# EasyEDA Pro project ProProject_PetCareSTM32_MiniSTM32_2024-08-24_5.epro

# Schematic Schematic1
Create Date: 2024-08-11; Page Name: P1; Project Name: PetCareSTM32_MiniSTM32; Schematic Name: Schematic1; Update Date: 2024-08-24; Company: 嘉立创EDA; Page Size: A4; Version: V1.0
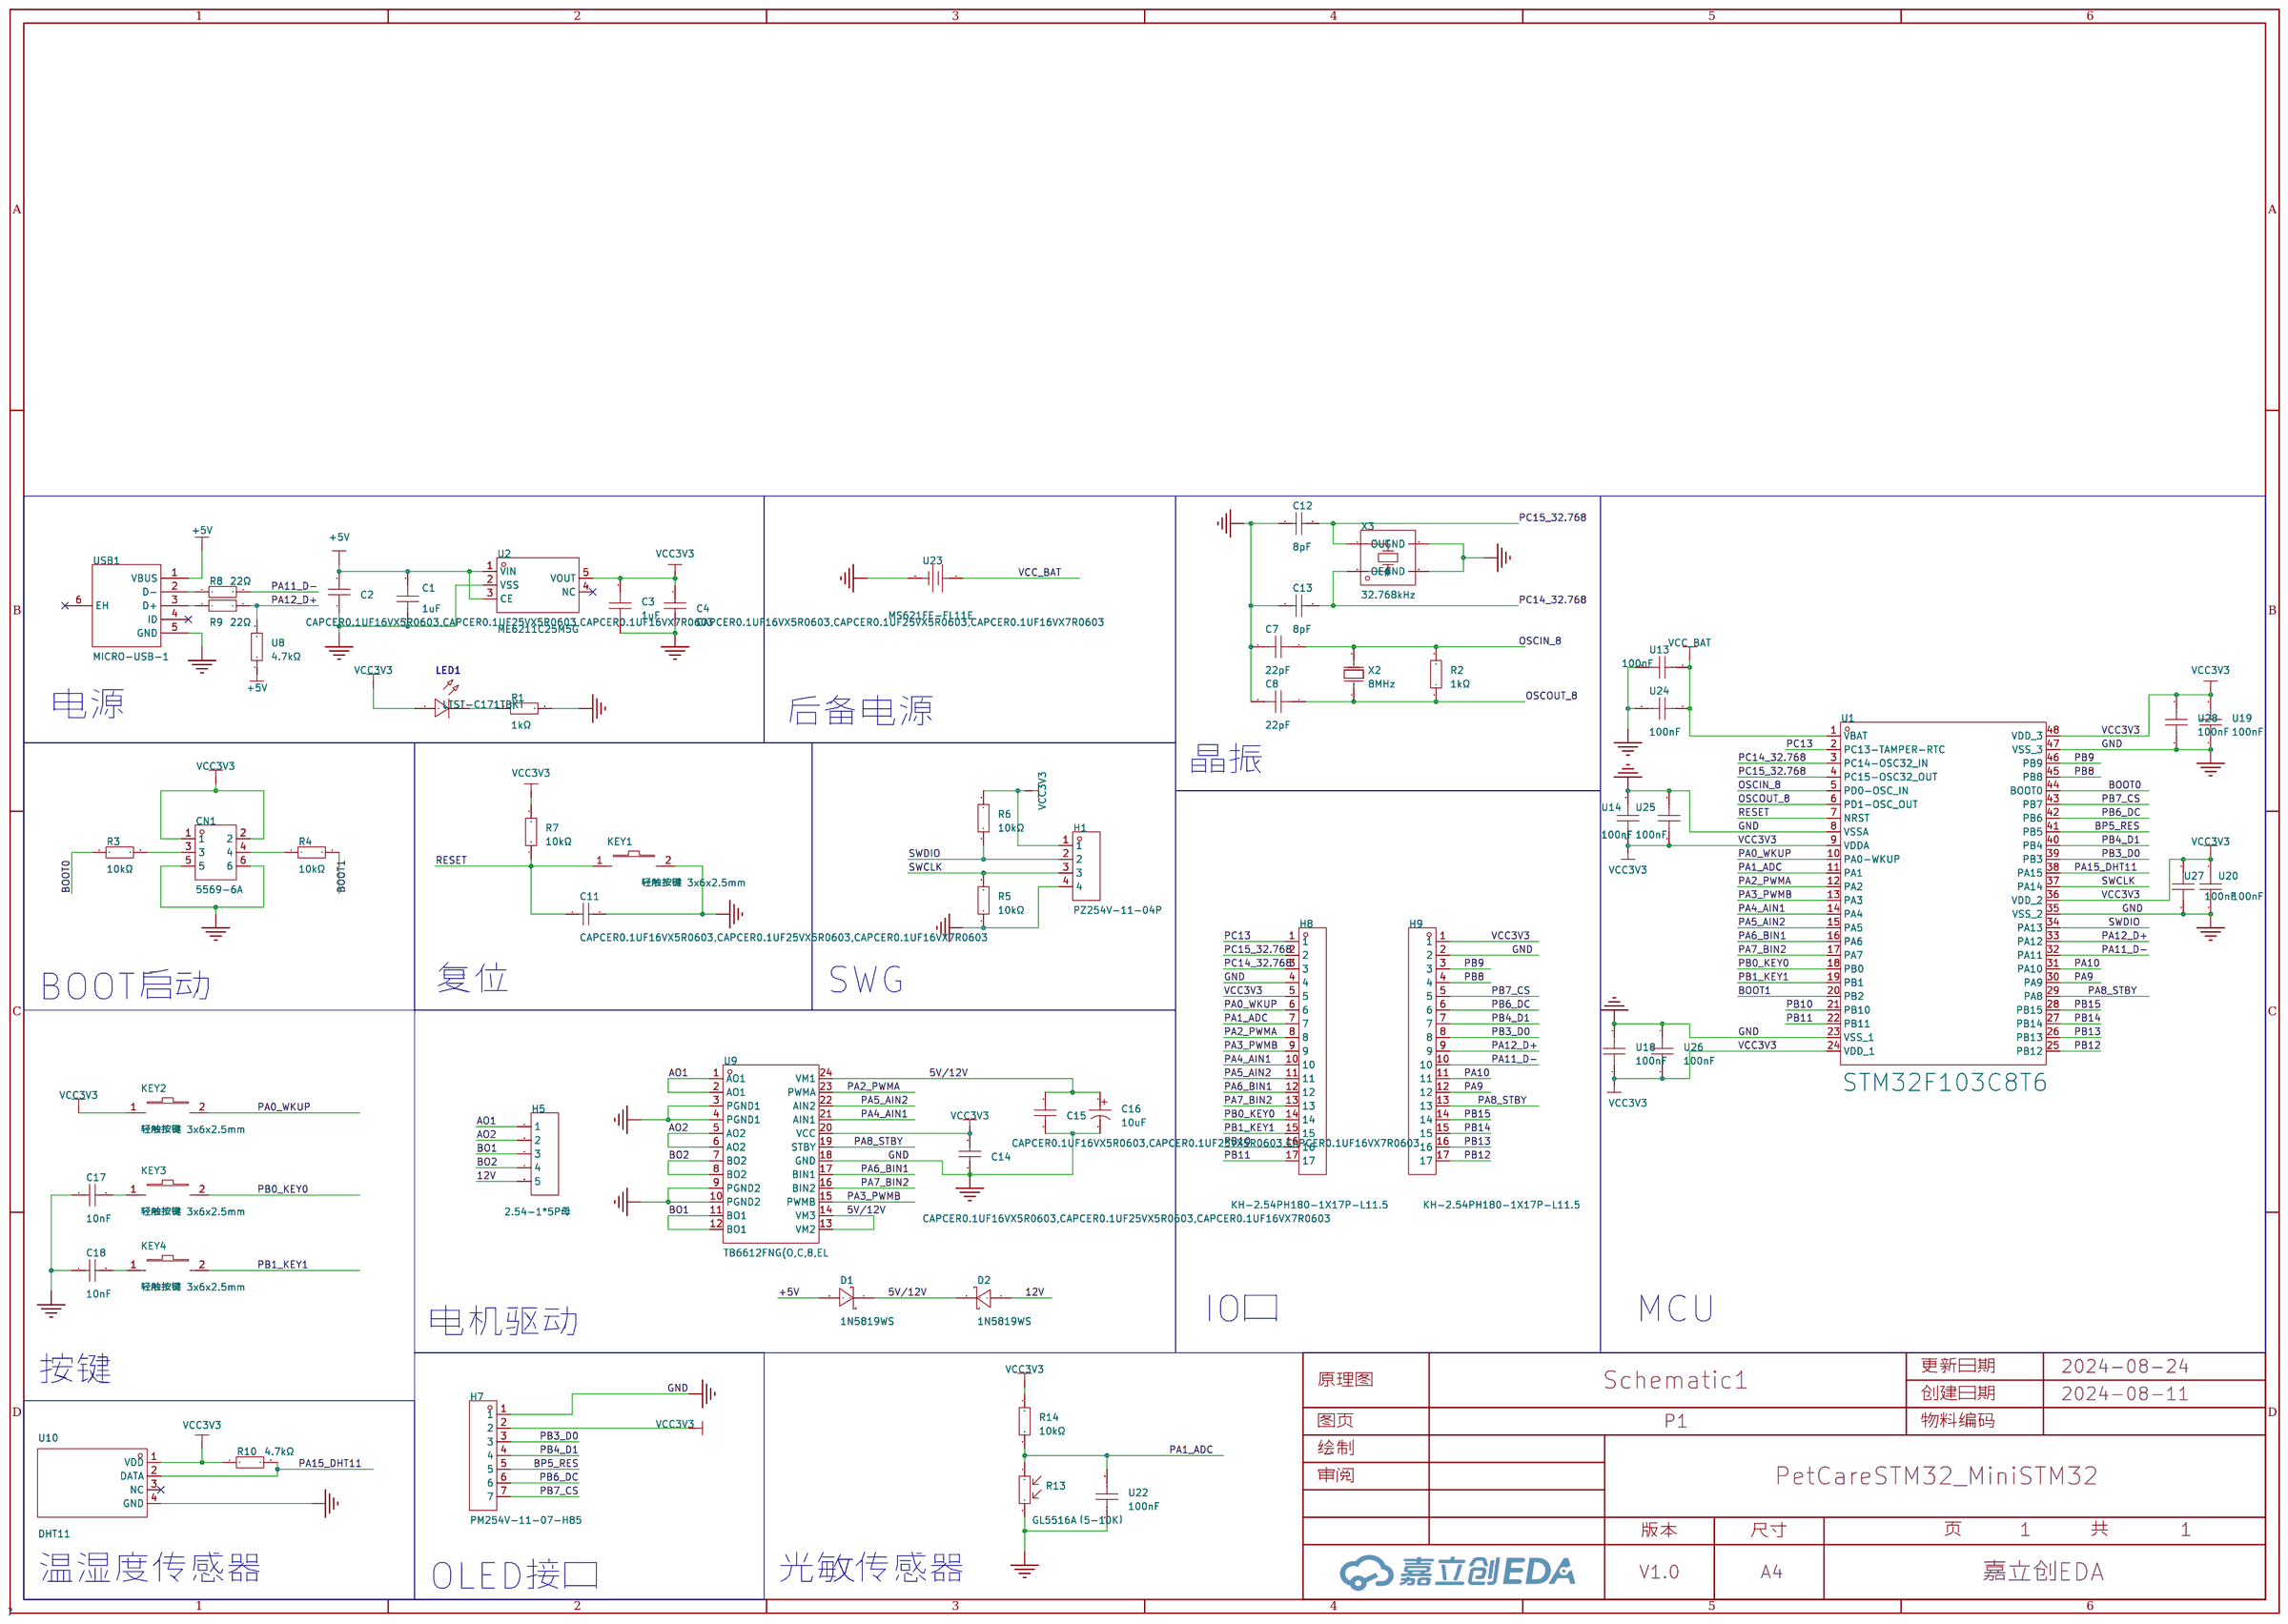
[diagram p0: schematic sheet]

## Parts
C1  1uF  [C0603]
C2  CAPCER0.1UF16VX5R0603,CAPCER0.1UF25VX5R0603,CAPCER0.1UF16VX7R0603  [C0603]
C3  1uF  [C0603]
C4  CAPCER0.1UF16VX5R0603,CAPCER0.1UF25VX5R0603,CAPCER0.1UF16VX7R0603  [C0603]
C7  22pF  [C0603]
C8  22pF  [C0603]
C11  CAPCER0.1UF16VX5R0603,CAPCER0.1UF25VX5R0603,CAPCER0.1UF16VX7R0603  [C0603]
C12  8pF  [C0603]
C13  8pF  [C0603]
C14  CAPCER0.1UF16VX5R0603,CAPCER0.1UF25VX5R0603,CAPCER0.1UF16VX7R0603  [C0603]
C15  CAPCER0.1UF16VX5R0603,CAPCER0.1UF25VX5R0603,CAPCER0.1UF16VX7R0603  [C0603]
C16  10uF  [CAP-TH_BD5.0-P2.00-D0.8-FD]
C17  10nF  [C0603]
C18  10nF  [C0603]
CN1  5569-6A  [CONN-TH_6P-P4.20_5569-6A-1]
D1  1N5819WS  [SOD-323_L1.8-W1.3-LS2.5-RD]
D2  1N5819WS  [SOD-323_L1.8-W1.3-LS2.5-RD]
H1  PZ254V-11-04P  [HDR-TH_4P-P2.54-V-M]
H5  2.54-1*5P母  [HDR-TH_5P-P2.54-V-F]
H7  PM254V-11-07-H85  [HDR-TH_7P-P2.54-V-F]
H8  KH-2.54PH180-1X17P-L11.5  [HDR-TH_17P-P2.54-V-M]
H9  KH-2.54PH180-1X17P-L11.5  [HDR-TH_17P-P2.54-V-M]
KEY1  轻触按键 3x6x2.5mm  [SW-SMD_L6.0-W3.6-LS8.0]
KEY2  轻触按键 3x6x2.5mm  [SW-SMD_L6.0-W3.6-LS8.0]
KEY3  轻触按键 3x6x2.5mm  [SW-SMD_L6.0-W3.6-LS8.0]
KEY4  轻触按键 3x6x2.5mm  [SW-SMD_L6.0-W3.6-LS8.0]
LED1  LTST-C171TBKT  [LED0805-RD_BLUE]
R1  1kΩ  [R0603]
R2  1kΩ  [R0603]
R3  10kΩ  [R0603]
R4  10kΩ  [R0603]
R5  10kΩ  [R0603]
R6  10kΩ  [R0603]
R7  10kΩ  [R0603]
R8  22Ω  [R0805]
R9  22Ω  [R0805]
R10  4.7kΩ  [R1206]
R13  GL5516A（5-10K）  [RES-TH_L5.1-W4.3-P3.40_GL55]
R14  10kΩ  [R0603]
U1  STM32F103C8T6  [LQFP-48_L7.0-W7.0-P0.50-LS9.0-BL]
U2  ME6211C25M5G  [SOT-23-5_L2.9-W1.7-P0.95-LS2.8-BL]
U8  4.7kΩ  [R0603]
U9  TB6612FNG(O,C,8,EL  [SSOP-24_L8.4-W5.8-P0.65-LS7.8-BL]
U10  DHT11  [SENSOR-TH_DHT11]
U13  100nF  [C0603]
U14  100nF  [C0603]
U18  100nF  [C0603]
U19  100nF  [C0603]
U20  100nF  [C0603]
U22  100nF  [C0603]
U23  MS621FE-FL11E  [BAT-SMD_FL11E]
U24  100nF  [C0603]
U25  100nF  [C0603]
U26  100nF  [C0603]
U27  100nF  [C0603]
U28  100nF  [C0603]
USB1  MICRO-USB-1  [MICRO-USB-SMD_C9900008946]
X2  8MHz  [OSC-SMD_L5.0-W3.2]
X3  32.768kHz  [CRYSTAL-SMD_4P-L8.0-W3.8-BL]

## Library data of the parts
C1 C3 = CL10A105KB8NNNC: 容值:1uF;精度:±10%;额定电压:50V;材质(温度系数):X5R;; LCSC Part Name: 1uF ±10% 50V; Supplier Part: C15849; Manufacturer: SAMSUNG(三星); Supplier Footprint: 0603; JLCPCB Part Class: Basic Part; Datasheet: https://atta.szlcsc.com/upload/public/pdf/source/20160218/1457707763339.pdf; Supplier: LCSC; Tolerance: ±10%; Voltage Rated: 50V; Temperature Coefficient: X5R
C2 C4 C11 C14 C15 = CAPCER0.1UF16VX5R0603,CAPCER0.1UF25VX5R0603,CAPCER0.1UF16VX7R0603: Supplier Part: C9900012833; JLCPCB Part Class: Extended Part; Supplier: LCSC
C7 C8 = CL10C220JB81PNC: 容值:22pF;精度:±5%;额定电压:50V;材质(温度系数):C0G;; LCSC Part Name: 22pF ±5% 50V; Supplier Part: C170132; Manufacturer: SAMSUNG(三星); Supplier Footprint: 0603; JLCPCB Part Class: Extended Part; Datasheet: https://atta.szlcsc.com/upload/public/pdf/source/20180126/C170132_15169630833661310807.pdf; Supplier: LCSC; Tolerance: ±5%; Voltage Rated: 50V; Temperature Coefficient: C0G
C12 C13 = 0603CG8R0C500NT: 容值:8pF;额定电压:50V;材质(温度系数):C0G;; LCSC Part Name: 8pF 50V; Supplier Part: C36508; Manufacturer: FH(风华); Supplier Footprint: 0603; JLCPCB Part Class: Extended Part; Datasheet: https://atta.szlcsc.com/upload/public/pdf/source/20200305/C486355_26A10D38EF8C2A5C37091D0039909270.pdf; Supplier: LCSC; Voltage Rated: 50V; Temperature Coefficient: C0G
C16 = KF100M025C110A: 容值:10uF;精度:±20%;额定电压:25V;; LCSC Part Name: 10uF ±20% 25V; Supplier Part: C62930; Manufacturer: CapXon(丰宾); Supplier Footprint: 插件,D5xL11mm; JLCPCB Part Class: Extended Part; Datasheet: https://atta.szlcsc.com/upload/public/pdf/source/20160702/1467448308274.pdf; Supplier: LCSC; Tolerance: ±20%; Rated Voltage: 25V; Lead Spacing: 2mm; φD: 5mm; L: 11mm; Lifetime @ Temp: 2000hrs@105℃
C17 C18 = CC0603KRX7R9BB103: 容值:10nF;精度:±10%;额定电压:50V;材质(温度系数):X7R;; LCSC Part Name: 10nF ±10% 50V; Supplier Part: C100042; Manufacturer: YAGEO(国巨); Supplier Footprint: 0603; JLCPCB Part Class: Extended Part; Datasheet: https://atta.szlcsc.com/upload/public/pdf/source/20181008/C309510_22F155564471FAF6A489F7D68F34234E.pdf; Supplier: LCSC; Tolerance: ±10%; Voltage Rated: 50V; Temperature Coefficient: X7R
CN1 = 5569-6A: Supplier Part: C9900070523; Supplier Footprint: 2*3p; JLCPCB Part Class: Extended Part; Supplier: LCSC
D1 D2 = 1N5819WS_C191023: 正向压降(Vf):600mV@1A;直流反向耐压(Vr):40V;平均整流电流(Io):1A;; LCSC Part Name: 电压:40V 电流:1A; Supplier Part: C191023; Manufacturer: Hottech(合科泰); Supplier Footprint: SOD-323; JLCPCB Part Class: Basic Part; Datasheet: https://atta.szlcsc.com/upload/public/pdf/source/20220428/3CB86FD8D28D653594B4E35F9D5AEFD9.pdf; Supplier: LCSC; Forward Voltage (Vf@If): 600mV@1A; Reverse Voltage (Vr): 40V; Average Rectified Current (Io): 1A
H1 = PZ254V-11-04P: 插针结构:1x4P;间距:2.54mm;行距:-;圆针/方针:方针;安装类型:直插;排数:单排;总PIN位数:4P;额定电流:3A;额定电压:250V;配合针长度:6mm;塑高:2.5mm;端接针长度:3mm;触头材质:-;工作温度范围:-40℃~+105℃;颜色:黑色;; LCSC Part Name: 间距:2.54mm 1x4P 直插 方针; Supplier Part: C2691448; Manufacturer: XFCN(兴飞); Supplier Footprint: 插件,P=2.54mm; JLCPCB Part Class: Extended Part; Datasheet: https://atta.szlcsc.com/upload/public/pdf/source/20200309/C492403_F9F19131791D08044AD4F84F8E751A34.pdf; Supplier: LCSC; Pin Structure: 1x4P; Pitch: 2.54mm; Circluar Pins/Square Pins: 方针; Mounting Type: 直插; Number of Rows: 单排; Number of Pins: 4P; Current Rating (Max): 3A; Voltage Rating (Max): 250V; Length of Mating Pin: 6mm; Insulation Height: 2.5mm; Length of End Connection Pin: 3mm; Operating Temperature Range: -40℃~+105℃; Color: 黑色
H5 = 2.54-1*5P母: 插孔结构:1x5P;间距:2.54mm;行距:-;安装类型:直插;排数:单排;总孔位数:5P;塑高:-;触头材质:-;触头镀层:-;; LCSC Part Name: 间距:2.54mm 1x5P 直插; Supplier Part: C50950; Manufacturer: BOOMELE(博穆精密); Supplier Footprint: 插件,P=2.54mm; JLCPCB Part Class: Extended Part; Datasheet: https://atta.szlcsc.com/upload/public/pdf/source/20210301/C2718488_F4427B881E42CAA8DDB0B1C12B3A522C.pdf; Supplier: LCSC; Holes Structure: 1x5P; Pitch: 2.54mm; Mounting Type: 直插; Number of Rows: 单排; Number of Holes: 5P
H7 = PM254V-11-07-H85: 插孔结构:1x7P;间距:2.54mm;行距:-;圆孔/方孔:方孔;安装类型:直插;排数:单排;总孔位数:7P;额定电流:3A;额定电压:250V;插孔方向:顶部;塑高:-;工作温度范围:-40℃~+105℃;; LCSC Part Name: 间距:2.54mm 1x7P 直插; Supplier Part: C2832270; Manufacturer: XFCN(兴飞); Supplier Footprint: 插件,P=2.54mm; JLCPCB Part Class: Extended Part; Datasheet: https://atta.szlcsc.com/upload/public/pdf/source/20210514/C2832270_F424CC0071A81298BFB56B53406F9842.pdf; Supplier: LCSC; Holes Structure: 1x7P; Pitch: 2.54mm; Circular Hole / Square Hole: 方孔; Mounting Type: 直插; Number of Rows: 单排; Number of Holes: 7P; Current Rating (Max): 3A; Voltage Rating (Max): 250V; Holes Direction: 顶部; Operating Temperature Range: -40℃~+105℃
H8 H9 = KH-2.54PH180-1X17P-L11.5: 插针结构:1x17P;间距:2.54mm;行距:-;圆针/方针:方针;安装类型:直插;排数:单排;总PIN位数:17P;额定电流:3A;额定电压:-;配合针长度:6mm;塑高:2.5mm;端接针长度:3mm;工作温度范围:-40℃~+105℃;颜色:黑色;; LCSC Part Name: 间距:2.54mm 1x17P 直插 方针; Supplier Part: C2932705; Manufacturer: kinghelm(金航标); Supplier Footprint: 插件,P=2.54mm; JLCPCB Part Class: Extended Part; Datasheet: https://atta.szlcsc.com/upload/public/pdf/source/20211220/20932CDD9C2552710798341E35ADE8E4.pdf; Supplier: LCSC; Pin Structure: 1x17P; Pitch: 2.54mm; Circluar Pins/Square Pins: 方针; Mounting Type: 直插; Number of Rows: 单排; Number of Pins: 17P; Current Rating (Max): 3A; Length of Mating Pin: 6mm; Insulation Height: 2.5mm; Length of End Connection Pin: 3mm; Operating Temperature Range: -40℃~+105℃; Color: 黑色
KEY1-KEY4 = 轻触按键 3x6x2.5mm: LCSC Part Name: 3x6x2.5 红头 耐高温; Supplier Part: C5382; Supplier Footprint: SMD; JLCPCB Part Class: Extended Part; Supplier: LCSC
LED1 = LTST-C171TBKT: 发光颜色:蓝色;正向电压(VF):3.3V;功率:76mW;正向电流:20mA;主波长:465nm~475nm;二极管配置:-;透镜颜色:无色透明透镜;色温:-;发光强度:104mcd;发光角度:130°;载带方式:-;工作温度:-20℃~+80℃;; LCSC Part Name: 蓝灯; Supplier Part: C98225; Manufacturer: LITEON(光宝); Supplier Footprint: 0805; JLCPCB Part Class: Extended Part; Datasheet: https://atta.szlcsc.com/upload/public/pdf/source/20170818/C98225_1503051350955895434.pdf; Supplier: LCSC; Emitted Color: 蓝色; Forward Voltage (VF): 3.3V; Power Dissipation: 76mW; Forward Current: 20mA; Dominant Wavelength: 465nm~475nm; Peak Wavelength: 468nm; Lens Color: 无色透明透镜; Luminous Intensity: 104mcd; Viewing Angle: 130°; Operating Temperature: -20℃~+80℃
R1 = RC0603FR-071KL: 电阻类型:厚膜电阻;阻值:1kΩ;精度:±1%;功率:100mW;最大工作电压:75V;温度系数:±100ppm/℃;; LCSC Part Name: 厚膜电阻 1kΩ ±1% 100mW; Supplier Part: C22548; Manufacturer: YAGEO(国巨); Supplier Footprint: 0603; JLCPCB Part Class: Extended Part; Datasheet: https://atta.szlcsc.com/upload/public/pdf/source/20180316/70C0E2BDAE7FCC62C531A5A58D202EE1.pdf; Supplier: LCSC; Type: 厚膜电阻; Tolerance: ±1%; Power(Watts): 100mW; Overload Voltage (Max): 75V; Temperature Coefficient: ±100ppm/℃; Operating Temperature Range: -55℃~+155℃
R2 = 0603WAD1001T5E: 电阻类型:厚膜电阻;阻值:1kΩ;精度:±0.5%;功率:100mW;最大工作电压:75V;温度系数:±100ppm/℃;; LCSC Part Name: 1kΩ ±0.5% 100mW 厚膜电阻; Supplier Part: C51218; Manufacturer: UNI-ROYAL(厚声); Supplier Footprint: 0603; JLCPCB Part Class: Extended Part; Datasheet: https://atta.szlcsc.com/upload/public/pdf/source/20200306/C422600_1E6D84923E4A46A82E41ADD87F860B5C.pdf; Supplier: LCSC; Type: 厚膜电阻; Tolerance: ±0.5%; Power(Watts): 100mW; Overload Voltage (Max): 75V; Temperature Coefficient: ±100ppm/℃; Operating Temperature Range: -55℃~+155℃
R3-R7 R14 = 0603WAF1002T5E: 电阻类型:厚膜电阻;阻值:10kΩ;精度:±1%;功率:100mW;最大工作电压:75V;温度系数:±100ppm/℃;; LCSC Part Name: 厚膜电阻 10kΩ ±1% 100mW; Supplier Part: C25804; Manufacturer: UNI-ROYAL(厚声); Supplier Footprint: 0603; JLCPCB Part Class: Basic Part; Datasheet: https://atta.szlcsc.com/upload/public/pdf/source/20200306/C422600_1E6D84923E4A46A82E41ADD87F860B5C.pdf; Supplier: LCSC; Type: 厚膜电阻; Tolerance: ±1%; Power(Watts): 100mW; Overload Voltage (Max): 75V; Temperature Coefficient: ±100ppm/℃; Operating Temperature Range: -55℃~+155℃
R8 R9 = TC0525F220JT5E: 电阻类型:薄膜电阻;阻值:22Ω;精度:±1%;功率:250mW;最大工作电压:150V;温度系数:±25ppm/℃;; LCSC Part Name: 22Ω ±1% 250mW 薄膜电阻; Supplier Part: C65068; Manufacturer: UNI-ROYAL(厚声); Supplier Footprint: 0805; JLCPCB Part Class: Extended Part; Datasheet: https://atta.szlcsc.com/upload/public/pdf/source/20190904/C425668_F2F639A313B6F33D501F342892FD5229.pdf; Supplier: LCSC; Type: 薄膜电阻; Tolerance: ±1%; Power(Watts): 250mW; Overload Voltage (Max): 150V; Temperature Coefficient: ±25ppm/℃; Operating Temperature Range: -55℃~+155℃
R10 = 1206W4F4701T5E: 电阻类型:厚膜电阻;阻值:4.7kΩ;精度:±1%;功率:250mW;最大工作电压:200V;温度系数:±100ppm/℃;; LCSC Part Name: 4.7kΩ ±1% 250mW 厚膜电阻; Supplier Part: C17936; Manufacturer: UNI-ROYAL(厚声); Supplier Footprint: 1206; JLCPCB Part Class: Basic Part; Datasheet: https://atta.szlcsc.com/upload/public/pdf/source/20200306/C422600_1E6D84923E4A46A82E41ADD87F860B5C.pdf; Supplier: LCSC; Type: 厚膜电阻; Tolerance: ±1%; Power(Watts): 250mW; Overload Voltage (Max): 200V; Temperature Coefficient: ±100ppm/℃; Operating Temperature Range: -55℃~+155℃
R13 = GL5516A（5-10K）: 暗电阻:200kΩ;亮电阻 @ 10Lux:5kΩ~10kΩ;光谱峰值(波长):540nm;; LCSC Part Name: 亮电阻:5kΩ~10kΩ 暗电阻:200kΩ; Supplier Part: C11307; Manufacturer: JCHL(晶创和立); Supplier Footprint: 插件,P=3.4mm; JLCPCB Part Class: Extended Part; Datasheet: https://atta.szlcsc.com/upload/public/pdf/source/20200417/C515010_C10502EF7F431E893A7F20DB83F527F0.pdf; Supplier: LCSC; Dark Resistance: 200kΩ; Illuminated Resistance @ 10Lux: 5kΩ~10kΩ; Applied Voltage: 150V; Spectral Peak: 540nm
U1 = STM32F103C8T6: CPU内核:ARM-M3;程序存储容量:64KB;RAM总容量:20KB;GPIO端口数量:37;工作电压范围:2V~3.6V;CPU最大主频:72MHz;程序存储器类型:FLASH;; LCSC Part Name: 主流增强型ARM Cortex-M3 MCU，具有64 KB Flash、72 MHz CPU、电机控制、USB和CAN; Supplier Part: C8734; Manufacturer: ST(意法半导体); Supplier Footprint: LQFP-48(7x7); JLCPCB Part Class: 扩展库; Datasheet: https://atta.szlcsc.com/upload/public/pdf/source/20220812/8363ACEC51AD55ECEB84799464F7CB85.pdf; Supplier: LCSC; CPU Core: ARM-M3; Program Storage Size: 64KB; RAM Size: 20KB; GPIO Ports Number: 37; Operating Voltage Range: 2V~3.6V; CPU Maximum Speed: 72MHz; Program Memory Type: FLASH; Operating Temperature Range: -40℃~+85℃; ADC (Bit): 12bit; Universal Serial Bus: 有; Peripheral/Function: 看门狗；DMA；看门狗；温度传感器; Watchdog: 有; Infrared Data Association: 有; Low-Voltage Detect: 有; Direct Memory Access: 有; Internal Oscillator: 有
U2 = ME6211C25M5G: LCSC Part Name: ME6211C25M5G 停产; Supplier Part: C2835813; Manufacturer: MICRONE(南京微盟); Supplier Footprint: SOT-23-5; JLCPCB Part Class: Extended Part; Datasheet: https://atta.szlcsc.com/upload/public/pdf/source/20211210/ACC7C3E9BA56F250BF966425916E32B9.pdf; Supplier: LCSC
U8 = AR03FTDX4701A: 电阻类型:薄膜电阻;阻值:4.7kΩ;精度:±1%;功率:100mW;最大工作电压:75V;温度系数:±50ppm/℃;; LCSC Part Name: 薄膜电阻 4.7kΩ ±1% 100mW; Supplier Part: C2924150; Manufacturer: Viking(光颉); Supplier Footprint: 0603; JLCPCB Part Class: Extended Part; Datasheet: https://atta.szlcsc.com/upload/public/pdf/source/20211123/7AFDB03DAF68AA91648A852AAE26A3AB.pdf; Supplier: LCSC; Type: 薄膜电阻; Tolerance: ±1%; Power(Watts): 100mW; Overload Voltage (Max): 75V; Temperature Coefficient: ±50ppm/℃; Operating Temperature Range: -55℃~+155℃
U9 = TB6612FNG(O,C,8,EL: 双直流电机驱动器集成电路; Supplier Part: C88224; Manufacturer: TOSHIBA(东芝); Supplier Footprint: SSOP-24-208mil; JLCPCB Part Class: Extended Part; Datasheet: https://atta.szlcsc.com/upload/public/pdf/source/20171128/C141517_15118625624231147036.pdf; Supplier: LCSC
U10 = DHT11: 新款电容式数字温湿度传感器,老款已停产16.1x12.6x5.8mm; LCSC Part Name: DHT11  电容式传感器; Supplier Part: C117051; Manufacturer: 广州奥松; Supplier Footprint: SIP-4; JLCPCB Part Class: Extended Part; Datasheet: https://atta.szlcsc.com/upload/public/pdf/source/20170703/1499081238365.pdf; Supplier: LCSC
U13 U14 U18-U20 U22 U24-U28 = CGA0603X7R104K500JT: 容值:100nF;精度:±10%;额定电压:50V;材质(温度系数):X7R;; LCSC Part Name: 100nF ±10% 50V; Supplier Part: C6119867; Manufacturer: HRE(芯声); Supplier Footprint: 0603; JLCPCB Part Class: Extended Part; Supplier: LCSC; Tolerance: ±10%; Voltage Rated: 50V; Temperature Coefficient: X7R
U23 = MS621FE-FL11E: FL11E 3.3V可充电纽扣电池 5.5mAH; LCSC Part Name: Seiko/精工，可充电纽扣电池，3V，MS621FE-FL11E，1个; Supplier Part: C80909; Manufacturer: Seiko(精工); JLCPCB Part Class: Extended Part; Datasheet: https://atta.szlcsc.com/upload/public/pdf/source/20230719/88F2811CC6B30DD05F1C5A5953BF9E77.pdf; Supplier: LCSC; voltage: 3 V; capacity: 5.5mAh; chemical composition: 锂离子; temperature range: -20-60°C; type: 纽扣; characteristic: 可充电; Packaging quantity: 1; Battery capacity: -；-；-
USB1 = MICRO-USB-1: Supplier Part: C9900008946; Supplier Footprint: USB-micro; JLCPCB Part Class: Extended Part; Supplier: LCSC
X2 = ABM3-8.000MHZ-D2Y-T: 晶振类型:贴片晶振;频率:8MHz;常温频差:±20ppm;外接负载电容:18pF;频率稳定度(全温):±30ppm;; LCSC Part Name: 8MHz ±20ppm 18pF; Supplier Part: C144380; Manufacturer: ABRACON; Supplier Footprint: SMD5032; JLCPCB Part Class: Extended Part; Datasheet: https://atta.szlcsc.com/upload/public/pdf/source/20180613/C148313_0A3B1F233FF88ED3B220BE4C181ABF14.pdf; Supplier: LCSC; Crystal Type: 贴片晶振; Normal temperature Frequency Tolerance: ±20ppm; External load capacitor: 18pF; Frequency Stability(Full temperature range): ±30ppm; Equivalent Series Resistance (ESR): 140Ω; Operating Temperature: -40℃~+85℃
X3 = ABS25-32.768KHZ-T: 晶振类型:-;频率:32.768kHz;常温频差:±20ppm;外接负载电容:12.5pF;频率稳定度(全温):-;; LCSC Part Name: 32.768kHz ±20ppm 12.5pF; Supplier Part: C179637; Manufacturer: ABRACON; Supplier Footprint: MC-306; JLCPCB Part Class: 扩展库; Datasheet: https://atta.szlcsc.com/upload/public/pdf/source/20180207/C179637_15179896523281356363.pdf; Supplier: LCSC; Normal temperature Frequency Tolerance: ±20ppm; External load capacitor: 12.5pF; Equivalent Series Resistance (ESR): 50kΩ; Operating Temperature: -40℃~+85℃

## Nets
5V/12V: C15.2 C16.1 D1.1(K) D2.1(K) U9.13(VM2) U9.14(VM3) U9.24(VM1)
12V: D2.2(A) H5.5
+5V: C1.2 C2.2 D1.2(A) U2.1(VIN) U2.3(CE) U8.1 USB1.1(VBUS)
GND: C1.1 C2.1 C3.1 C4.1 C7.2 C8.2 C11.2 C12.1 C13.1 C14.1 C15.1 C16.2 C17.2 C18.1 CN1.5 CN1.6 H1.4 H7.1 H8.4 H9.2 KEY1.2 R1.2 R5.1 R13.2 U1.8(VSSA) U1.23(VSS_1) U1.35(VSS_2) U1.47(VSS_3) U2.2(VSS) U9.3(PGND1) U9.4(PGND1) U9.9(PGND2) U9.10(PGND2) U9.18(GND) U10.4(GND) U13.2 U14.2 U18.2 U19.1 U20.1 U22.1 U23.2(-) U24.2 U25.1 U26.1 U27.2 U28.2 USB1.5(GND) X3.2(GND) X3.3(GND)
VCC3V3: C3.2 C4.2 C14.2 CN1.1 CN1.2 H1.1 H7.2 H8.5 H9.1 KEY2.1 LED1.2(A) R6.2 R7.2 R10.1 R14.2 U1.9(VDDA) U1.24(VDD_1) U1.36(VDD_2) U1.48(VDD_3) U2.5(VOUT) U9.20(VCC) U10.1(VDD) U14.1 U18.1 U19.2 U20.2 U25.2 U26.2 U27.1 U28.1
VCC_BAT: U1.1(VBAT) U13.1 U23.1(+) U24.1
AO1: H5.1 U9.1(AO1) U9.2(AO1)
AO2: H5.2 U9.5(AO2) U9.6(AO2)
BO1: H5.3 U9.11(BO1) U9.12(BO1)
BO2: H5.4 U9.7(BO2) U9.8(BO2)
BOOT0: R3.1 U1.44(BOOT0)
BOOT1: R4.2 U1.20(PB2)
BP5_RES: H7.5 U1.41(PB5)
OSCIN_8: C7.1 R2.2 U1.5(PD0-OSC_IN) X2.2(OSC2)
OSCOUT_8: C8.1 R2.1 U1.6(PD1-OSC_OUT) X2.1(OSC1)
PA0_WKUP: H8.6 KEY2.2 U1.10(PA0-WKUP)
PA1_ADC: H8.7 R13.1 R14.1 U1.11(PA1) U22.2
PA2_PWMA: H8.8 U1.12(PA2) U9.23(PWMA)
PA3_PWMB: H8.9 U1.13(PA3) U9.15(PWMB)
PA4_AIN1: H8.10 U1.14(PA4) U9.21(AIN1)
PA5_AIN2: H8.11 U1.15(PA5) U9.22(AIN2)
PA6_BIN1: H8.12 U1.16(PA6) U9.17(BIN1)
PA7_BIN2: H8.13 U1.17(PA7) U9.16(BIN2)
PA8_STBY: H9.13 U1.29(PA8) U9.19(STBY)
PA9: H9.12 U1.30(PA9)
PA10: H9.11 U1.31(PA10)
PA11_D-: H9.10 R8.2 U1.32(PA11)
PA12_D+: H9.9 R9.2 U1.33(PA12) U8.2
PA15_DHT11: R10.2 U1.38(PA15) U10.2(DATA)
PB0_KEY0: H8.14 KEY3.2 U1.18(PB0)
PB1_KEY1: H8.15 KEY4.2 U1.19(PB1)
PB3_D0: H7.3 H9.8 U1.39(PB3)
PB4_D1: H7.4 H9.7 U1.40(PB4)
PB6_DC: H7.6 H9.6 U1.42(PB6)
PB7_CS: H7.7 H9.5 U1.43(PB7)
PB8: H9.4 U1.45(PB8)
PB9: H9.3 U1.46(PB9)
PB10: H8.16 U1.21(PB10)
PB11: H8.17 U1.22(PB11)
PB12: H9.17 U1.25(PB12)
PB13: H9.16 U1.26(PB13)
PB14: H9.15 U1.27(PB14)
PB15: H9.14 U1.28(PB15)
PC13: H8.1 U1.2(PC13-TAMPER-RTC)
PC14_32.768: C13.2 H8.3 U1.3(PC14-OSC32_IN) X3.1(OE#)
PC15_32.768: C12.2 H8.2 U1.4(PC15-OSC32_OUT) X3.4(OUT)
RESET: C11.1 KEY1.1 R7.1 U1.7(NRST)
SWCLK: H1.3 R5.2 U1.37(PA14)
SWDIO: H1.2 R6.1 U1.34(PA13)
$1N4524: LED1.1(C) R1.1
$1N6705: CN1.3 R3.2
$1N6712: CN1.4 R4.1
$1N8192: R8.1 USB1.2(D-)
$1N8237: R9.1 USB1.3(D+)
$1N32184: C17.1 KEY3.1
$1N32195: C18.2 KEY4.1

Not connected (* = marked no-connect by the designer): U2 4(NC)*; U10 3(NC)*; USB1 4(ID)* 6(EH)*

## Notes on the sheet
- 电源
- 后备电源
- 晶振
- BOOT启动
- 复位
- SWG
- IO口
- MCU
- 电机驱动
- 按键
- 温湿度传感器
- 光敏传感器
- OLED接口

# Board PCB1
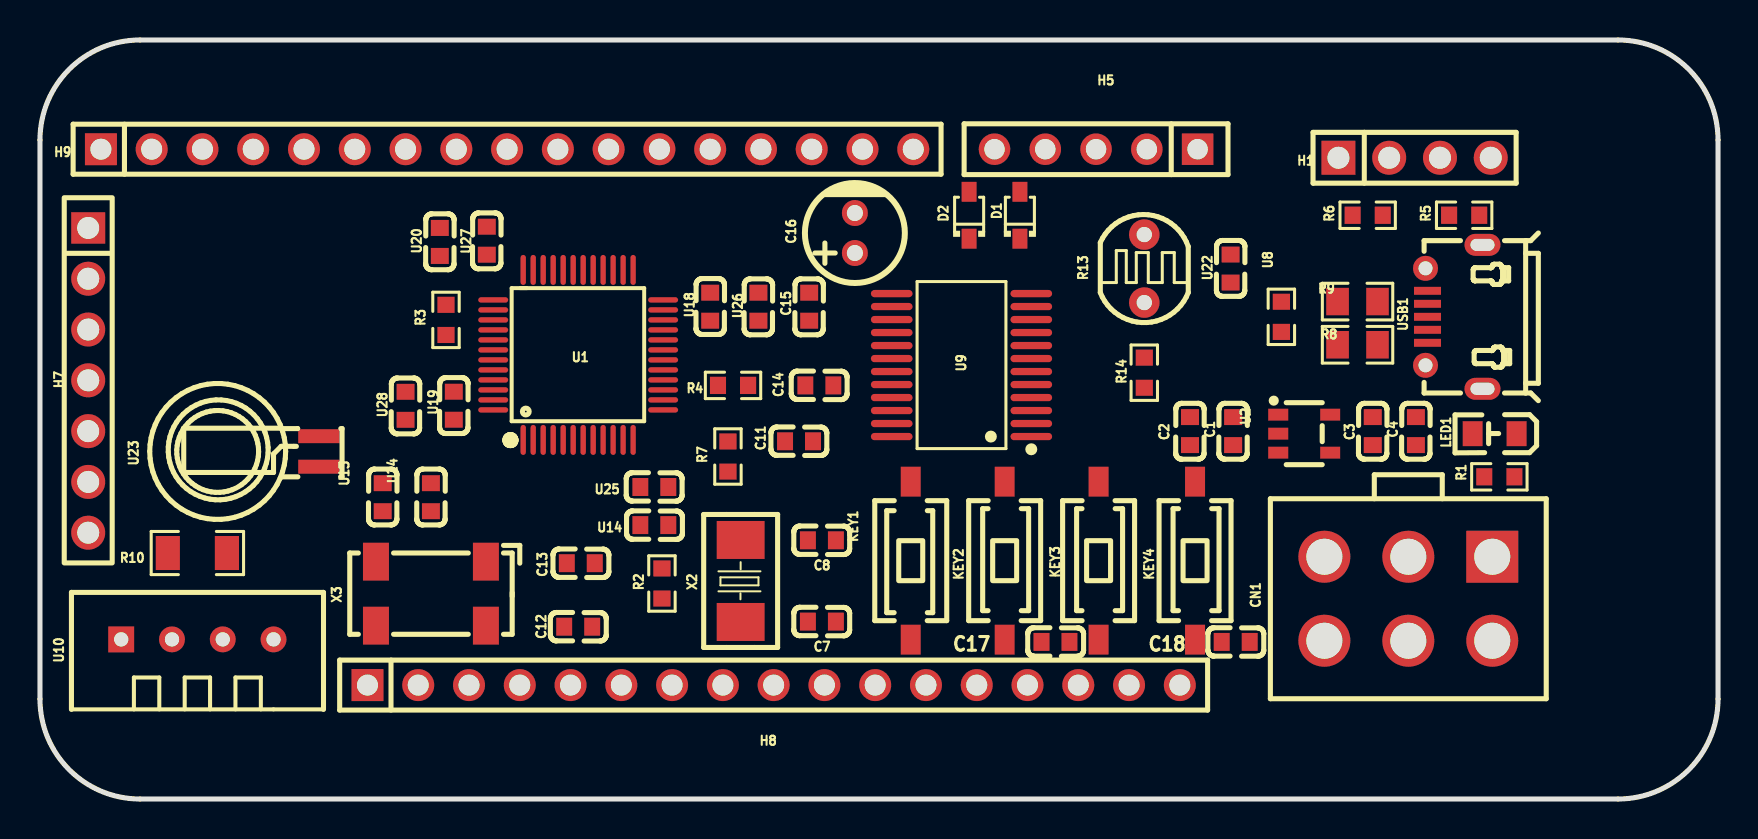
[diagram p1: board, top side]
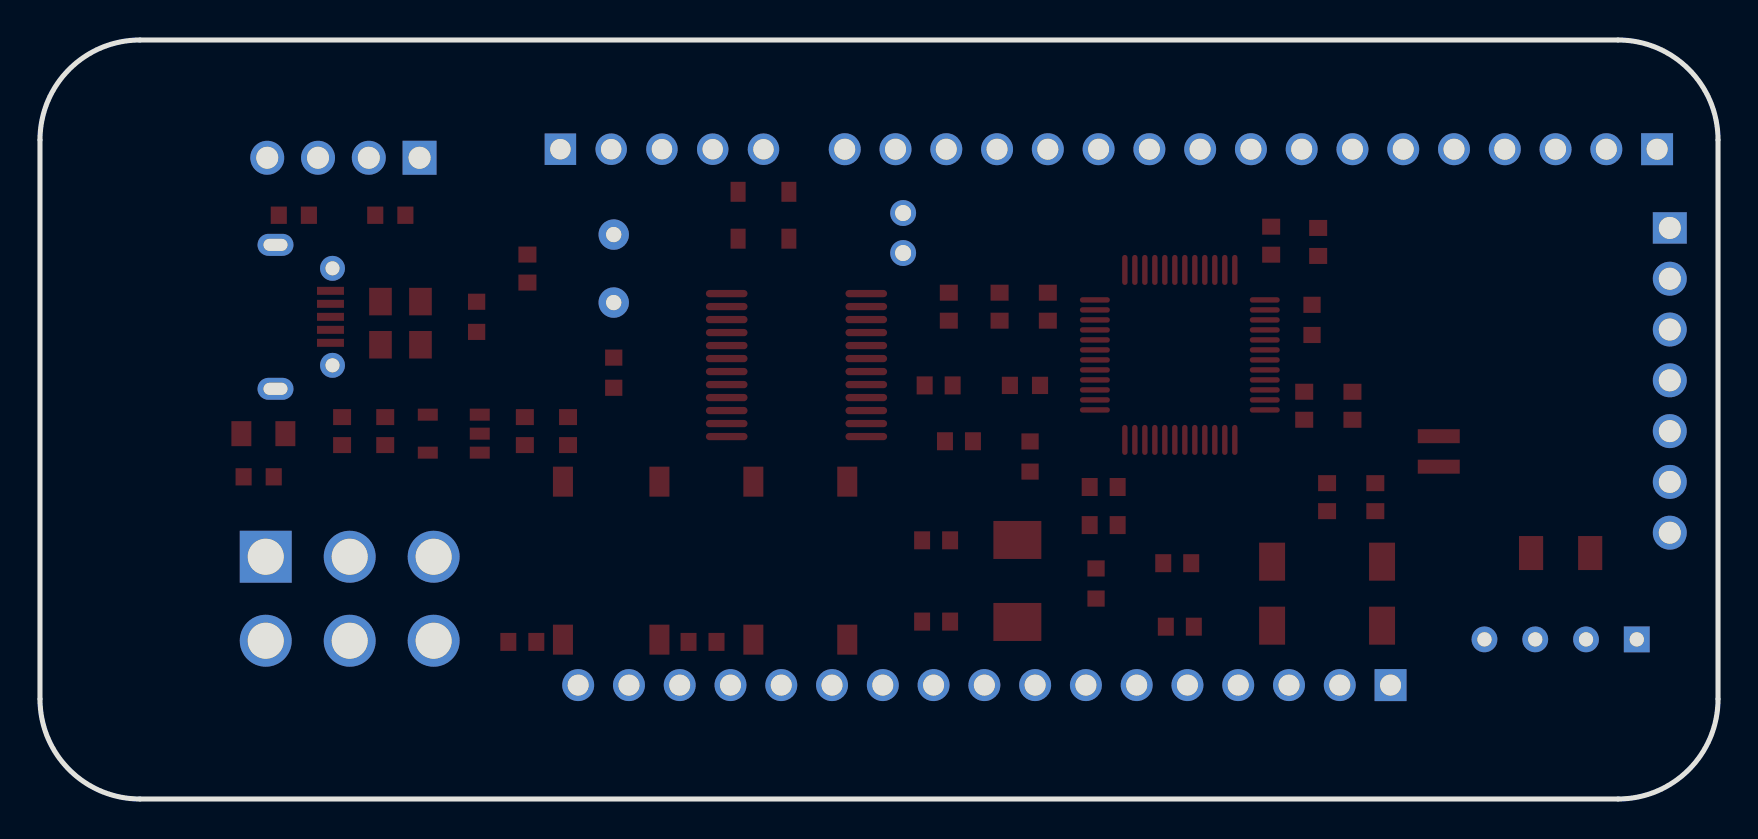
[diagram p2: board, bottom side, seen from below]

Outline 83.95 x 37.95 mm; copper layers: Top Layer, Bottom Layer. Coordinates in mm from the lower left corner of the outline.
Outline path: 0,32.95 0,5 arc(1.46,1.46) 5,0 78.95,0 arc(82.48,1.46) 83.95,5 83.95,32.95 arc(82.48,36.49) 78.95,37.95 5,37.95 arc(1.46,36.49) 0,32.95
Stack: Top Layer 0.035mm / Dielectric1 1.51mm FR4 er 4.5 / Bottom Layer 0.035mm

## Design rules (mm)
template: 自定义配置
spacing copperThickness1oz (default): track to track 0.152, other pairs 0.152 to 0.3
spacing copperThickness2oz: track to track 0.203, other pairs 0.152 to 0.3
track width copperThickness1oz (default): min 0.254, default 0.254, max 0.762
track width copperThickness2oz: min 0.203, default 0.254, max 2.54
track width 5V: min 0.381, default 0.381, max 0.762
track width 12V: min 0.508, default 0.508, max 0.762
differential pair differentialPair (default): width min 0.127, default 0.254, max 2.54; gap min 0.152, default 0.152
via viaSize (default): diameter min 0.5, default 0.61, max 10; hole min 0.3, default 0.305, max 6.299
net +5V uses 5V
net 5V/12V uses 12V
net 12V uses 12V

## Placement (name value [footprint] x y rotation side)
C1  1uF  [C0603]  59.69 18.4 90 top
C2  CAPCER0.1UF16VX5R0603,CAPCER0.1UF25VX5R0603,CAPCER0.1UF16VX7R0603  [C0603]  57.53 18.4 90 top
C3  1uF  [C0603]  66.67 18.4 90 top
C4  CAPCER0.1UF16VX5R0603,CAPCER0.1UF25VX5R0603,CAPCER0.1UF16VX7R0603  [C0603]  68.83 18.4 90 top
C7  22pF  [C0603]  39.12 8.87 0 top
C8  22pF  [C0603]  39.12 12.93 0 top
C11  CAPCER0.1UF16VX5R0603,CAPCER0.1UF25VX5R0603,CAPCER0.1UF16VX7R0603  [C0603]  37.97 17.89 0 top
C12  8pF  [C0603]  26.92 8.62 180 top
C13  8pF  [C0603]  27.05 11.79 180 top
C14  CAPCER0.1UF16VX5R0603,CAPCER0.1UF25VX5R0603,CAPCER0.1UF16VX7R0603  [C0603]  38.99 20.68 0 top
C15  CAPCER0.1UF16VX5R0603,CAPCER0.1UF25VX5R0603,CAPCER0.1UF16VX7R0603  [C0603]  38.48 24.62 90 top
C16  10uF  [CAP-TH_BD5.0-P2.00-D0.8-FD]  40.77 28.3 90 top
C17  10nF  [C0603]  50.8 7.85 180 top
C18  10nF  [C0603]  59.82 7.85 180 top
CN1  5569-6A  [CONN-TH_6P-P4.20_5569-6A-1]  68.45 10.01 180 top
D1  1N5819WS  [SOD-323_L1.8-W1.3-LS2.5-RD]  49.02 29.19 90 top
D2  1N5819WS  [SOD-323_L1.8-W1.3-LS2.5-RD]  46.48 29.19 90 top
H1  PZ254V-11-04P  [HDR-TH_4P-P2.54-V-M]  68.77 32.06 0 top
H5  2.54-1*5P母  [HDR-TH_5P-P2.54-V-F]  52.83 32.49 180 top
H7  PM254V-11-07-H85  [HDR-TH_7P-P2.54-V-F]  2.41 20.94 270 top
H8  KH-2.54PH180-1X17P-L11.5  [HDR-TH_17P-P2.54-V-M]  36.7 5.7 0 top
H9  KH-2.54PH180-1X17P-L11.5  [HDR-TH_17P-P2.54-V-M]  23.37 32.49 0 top
KEY1  轻触按键 3x6x2.5mm  [SW-SMD_L6.0-W3.6-LS8.0]  43.56 11.92 270 top
KEY2  轻触按键 3x6x2.5mm  [SW-SMD_L6.0-W3.6-LS8.0]  48.26 11.92 90 top
KEY3  轻触按键 3x6x2.5mm  [SW-SMD_L6.0-W3.6-LS8.0]  52.96 11.92 90 top
KEY4  轻触按键 3x6x2.5mm  [SW-SMD_L6.0-W3.6-LS8.0]  57.79 11.92 90 top
LED1  LTST-C171TBKT  [LED0805-RD_BLUE]  72.77 18.27 180 top
R1  1kΩ  [R0603]  73.01 16.11 180 top
R2  1kΩ  [R0603]  31.11 10.78 270 top
R3  10kΩ  [R0603]  20.31 23.96 90 top
R4  10kΩ  [R0603]  34.67 20.68 180 top
R5  10kΩ  [R0603]  71.25 29.19 180 top
R6  10kΩ  [R0603]  66.42 29.19 180 top
R7  10kΩ  [R0603]  34.42 17.13 270 top
R8  22Ω  [R0805]  65.91 22.71 180 top
R9  22Ω  [R0805]  65.91 24.87 180 top
R10  4.7kΩ  [R1206]  7.87 12.3 0 top
R13  GL5516A（5-10K）  [RES-TH_L5.1-W4.3-P3.40_GL55]  55.25 26.52 180 top
R14  10kΩ  [R0603]  55.25 21.32 270 top
U1  STM32F103C8T6  [LQFP-48_L7.0-W7.0-P0.50-LS9.0-BL]  26.92 22.21 0 top
U2  ME6211C25M5G  [SOT-23-5_L2.9-W1.7-P0.95-LS2.8-BL]  63.25 18.27 270 top
U8  4.7kΩ  [R0603]  62.1 24.11 90 top
U9  TB6612FNG(O,C,8,EL  [SSOP-24_L8.4-W5.8-P0.65-LS7.8-BL]  46.1 21.7 90 top
U10  DHT11  [SENSOR-TH_DHT11]  7.87 7.98 0 top
U13  100nF  [C0603]  17.15 15.09 270 top
U14  100nF  [C0603]  30.73 13.7 180 top
U18  100nF  [C0603]  33.53 24.62 270 top
U19  100nF  [C0603]  20.7 19.67 270 top
U20  100nF  [C0603]  20 27.86 270 top
U22  100nF  [C0603]  59.56 26.52 270 top
U23  MS621FE-FL11E  [BAT-SMD_FL11E]  13.97 17.38 0 top
U24  100nF  [C0603]  19.56 15.09 270 top
U25  100nF  [C0603]  30.73 15.6 0 top
U26  100nF  [C0603]  35.94 24.62 90 top
U27  100nF  [C0603]  22.36 27.92 90 top
U28  100nF  [C0603]  18.29 19.66 90 top
USB1  MICRO-USB-1  [MICRO-USB-SMD_C9900008946]  70.74 24.11 90 top
X2  8MHz  [OSC-SMD_L5.0-W3.2]  35.05 10.9 270 top
X3  32.768kHz  [CRYSTAL-SMD_4P-L8.0-W3.8-BL]  19.56 10.27 180 top

## Footprints (pads in the part's own frame, mm; a bottom-side part is the same pattern mirrored in y, then rotated)
BAT-SMD_FL11E
  rect 2.1x0.7 smd: 1(0,0.762) 2(0,-0.762)
C0603
  rect 0.8x0.9 smd: 1(-0.7,0) 2(0.7,0)
CAP-TH_BD5.0-P2.00-D0.8-FD
  round 1.3 hole 0.8: 1(-1,0) 2(1,0)
CONN-TH_6P-P4.20_5569-6A-1
  rect 2.6x2.6 hole 1.8: 1(-4.2,-2.1)
  round 2.6 hole 1.8: 2(-4.2,2.1) 3(0,-2.1) 4(0,2.1) 5(4.2,-2.1) 6(4.2,2.1)
CRYSTAL-SMD_4P-L8.0-W3.8-BL
  rect 1.3x1.9 smd: 1(-2.75,-1.6) 2(2.75,-1.6) 3(2.75,1.6) 4(-2.75,1.6)
HDR-TH_4P-P2.54-V-M
  rect 1.7x1.7 hole 1.1: 1(-3.81,0)
  round 1.7 hole 1.1: 2(-1.27,0) 3(1.27,0) 4(3.81,0)
HDR-TH_5P-P2.54-V-F
  rect 1.575x1.575 hole 1.02: 1(-5.08,0)
  round 1.575 hole 1.02: 2(-2.54,0) 3(0,0) 4(2.54,0) 5(5.08,0)
HDR-TH_7P-P2.54-V-F
  rect 1.575x1.7 hole 1.1: 1(-7.62,0)
  round 1.7 hole 1.1: 2(-5.08,0) 3(-2.54,0) 4(0,0) 5(2.54,0) 6(5.08,0) 7(7.62,0)
HDR-TH_17P-P2.54-V-M
  rect 1.6x1.6 hole 1.05: 1(-20.32,0)
  round 1.6 hole 1.05: 2(-17.78,0) 3(-15.24,0) 4(-12.7,0) 5(-10.16,0) 6(-7.62,0) 7(-5.08,0) 8(-2.54,0) 9(0,0) 10(2.54,0) 11(5.08,0) 12(7.62,0) 13(10.16,0) 14(12.7,0) 15(15.24,0) 16(17.78,0) 17(20.32,0)
LED0805-RD_BLUE
  rect 1x1.25 smd: 1(-1.1,0) 2(1.1,0)
LQFP-48_L7.0-W7.0-P0.50-LS9.0-BL
  oval 0.27x1.5 smd: 1(-2.75,-4.25) 2(-2.25,-4.25) 3(-1.75,-4.25) 4(-1.25,-4.25) 5(-0.75,-4.25) 6(-0.25,-4.25) 7(0.25,-4.25) 8(0.75,-4.25) 9(1.25,-4.25) 10(1.75,-4.25) 11(2.25,-4.25) 12(2.75,-4.25) 25(2.75,4.25) 26(2.25,4.25) 27(1.75,4.25) 28(1.25,4.25) 29(0.75,4.25) 30(0.25,4.25) 31(-0.25,4.25) 32(-0.75,4.25) 33(-1.25,4.25) 34(-1.75,4.25) 35(-2.25,4.25) 36(-2.75,4.25)
  oval 1.5x0.27 smd: 13(4.25,-2.75) 14(4.25,-2.25) 15(4.25,-1.75) 16(4.25,-1.25) 17(4.25,-0.75) 18(4.25,-0.25) 19(4.25,0.25) 20(4.25,0.75) 21(4.25,1.25) 22(4.25,1.75) 23(4.25,2.25) 24(4.25,2.75) 37(-4.25,2.75) 38(-4.25,2.25) 39(-4.25,1.75) 40(-4.25,1.25) 41(-4.25,0.75) 42(-4.25,0.25) 43(-4.25,-0.25) 44(-4.25,-0.75) 45(-4.25,-1.25) 46(-4.25,-1.75) 47(-4.25,-2.25) 48(-4.25,-2.75)
MICRO-USB-SMD_C9900008946
  rect 0.4x1.35 smd: 1(-1.3,1.325) 2(-0.65,1.325) 3(0,1.325) 4(0.65,1.325) 5(1.3,1.325)
  oval 1.1x1.8 hole 0.6x1.2: 6(-3.6,-1.425) 6(3.6,-1.425)
  round 1.25 hole 0.7: 6(-2.425,1.425) 6(2.425,1.425)
OSC-SMD_L5.0-W3.2
  rect 1.9x2.4 smd: 1(-2.05,0) 2(2.05,0)
R0603
  rect 0.806x0.864 smd: 1(-0.753,0) 2(0.753,0)
R0805
  rect 1.133x1.377 smd: 1(-1,0) 2(1,0)
R1206
  rect 1.208x1.701 smd: 1(-1.479,0) 2(1.479,0)
RES-TH_L5.1-W4.3-P3.40_GL55
  round 1.524 hole 0.762: 1(0,1.7) 2(0,-1.7)
SENSOR-TH_DHT11
  rect 1.296x1.296 hole 0.711: 1(-3.81,0)
  round 1.296 hole 0.711: 2(-1.27,0) 3(1.27,0) 4(3.81,0)
SOD-323_L1.8-W1.3-LS2.5-RD
  rect 1x0.75 smd: 1(-1.173,0) 2(1.173,0)
SOT-23-5_L2.9-W1.7-P0.95-LS2.8-BL
  rect 0.6x1 smd: 1(-0.95,-1.3) 2(0,-1.3) 3(0.95,-1.3) 4(0.95,1.3) 5(-0.95,1.3)
SSOP-24_L8.4-W5.8-P0.65-LS7.8-BL
  oval 0.364x2.082 smd: 1(-3.575,-3.491) 2(-2.925,-3.491) 3(-2.275,-3.491) 4(-1.625,-3.491) 5(-0.975,-3.491) 6(-0.325,-3.491) 7(0.325,-3.491) 8(0.975,-3.491) 9(1.625,-3.491) 10(2.275,-3.491) 11(2.925,-3.491) 12(3.575,-3.491) 13(3.575,3.491) 14(2.925,3.491) 15(2.275,3.491) 16(1.625,3.491) 17(0.975,3.491) 18(0.325,3.491) 19(-0.325,3.491) 20(-0.975,3.491) 21(-1.625,3.491) 22(-2.275,3.491) 23(-2.925,3.491) 24(-3.575,3.491)
SW-SMD_L6.0-W3.6-LS8.0
  rect 1.5x1 smd: 1(-3.95,0) 2(3.95,0)

## Nets
As in the schematic.

Pads without a net: U2 4; U10 3; USB1 4 6
